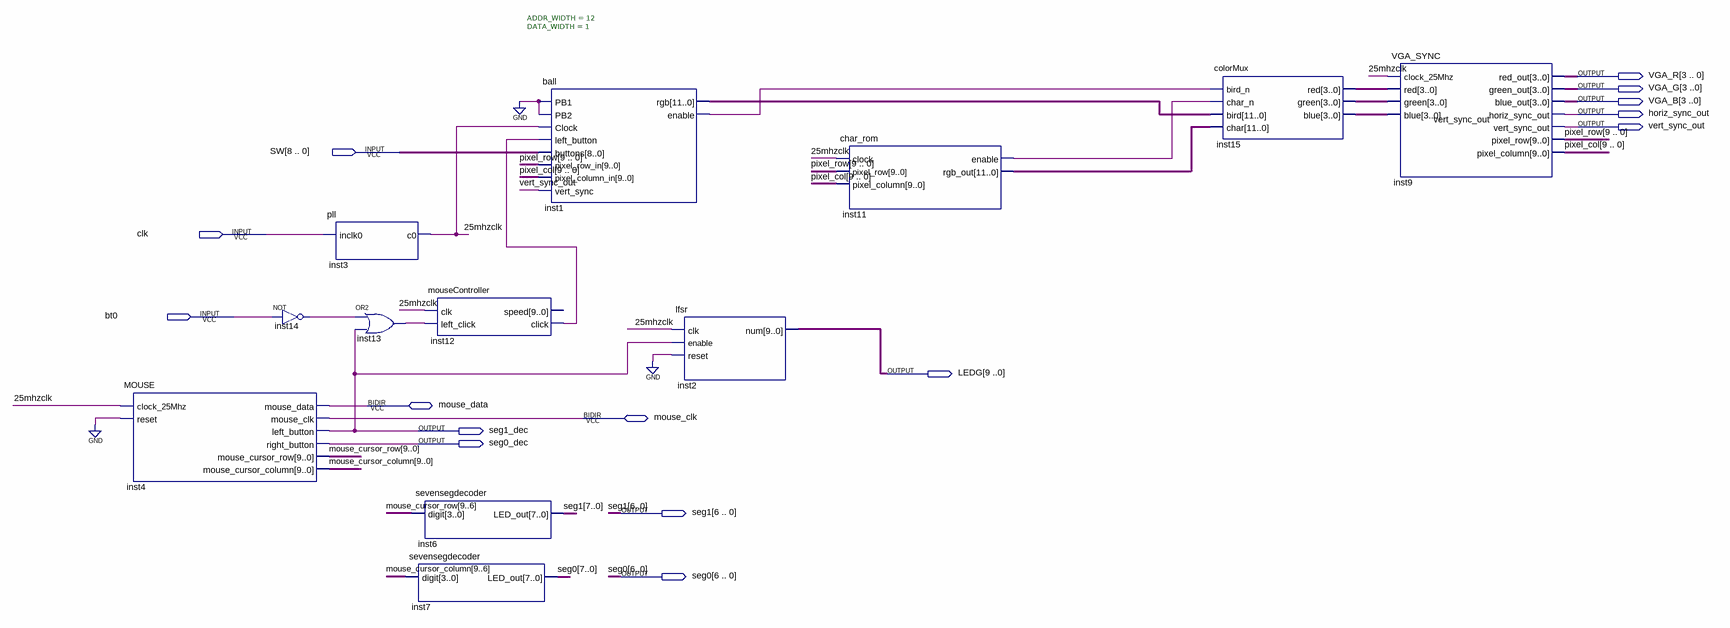
[diagram p0: schematic sheet]
// Quartus schematic BouncingBall.bdf as structural Verilog: 12 symbols, 15 pins
module BouncingBall (
  input  [8:0] SW,
  input  clk,
  input  bt0,
  inout  mouse_data,
  inout  mouse_clk,
  output [3:0] VGA_R,
  output [3:0] VGA_G,
  output [3:0] VGA_B,
  output horiz_sync_out,
  output vert_sync_out,
  output [9:0] LEDG,
  output seg1_dec,
  output seg0_dec,
  output [7:0] seg1,
  output [7:0] seg0
);

  wire \25mhzclk , inst1_enable, inst11_enable, inst12_click, inst13_out, inst14_out;
  wire [3:0] inst15_blue, inst15_green, inst15_red;
  wire [9:0] mouse_cursor_column, mouse_cursor_row, pixel_col, pixel_row;
  wire [11:0] inst1_rgb, inst11_rgb_out;

  MOUSE inst4 (
    .clock_25Mhz(\25mhzclk ), .reset(1'b0), .left_button(seg1_dec), .right_button(seg0_dec),
    .mouse_cursor_row(mouse_cursor_row), .mouse_cursor_column(mouse_cursor_column), .mouse_data(mouse_data),
    .mouse_clk(mouse_clk));
  not inst14 (inst14_out, bt0);
  pll inst3 (.inclk0(clk), .c0(\25mhzclk ));
  or inst13 (inst13_out, inst14_out, seg1_dec);
  mouseController inst12 (.clk(\25mhzclk ), .left_click(inst13_out), .click(inst12_click));  // open: speed
  sevensegdecoder inst6 (.digit(mouse_cursor_row[9:6]), .LED_out(seg1));
  sevensegdecoder inst7 (.digit(mouse_cursor_column[9:6]), .LED_out(seg0));
  ball #(.ADDR_WIDTH(12), .DATA_WIDTH(1)) inst1 (
    .PB1(1'b0), .PB2(1'b0), .Clock(\25mhzclk ), .left_button(inst12_click), .buttons(SW),
    .pixel_row_in(pixel_row), .pixel_column_in(pixel_col), .vert_sync(vert_sync_out), .rgb(inst1_rgb),
    .enable(inst1_enable));
  lfsr inst2 (.clk(\25mhzclk ), .enable(seg1_dec), .reset(1'b0), .num(LEDG));
  char_rom inst11 (
    .clock(\25mhzclk ), .pixel_row(pixel_row), .pixel_column(pixel_col), .enable(inst11_enable),
    .rgb_out(inst11_rgb_out));
  colorMux inst15 (
    .bird_n(inst1_enable), .char_n(inst11_enable), .bird(inst1_rgb), .char(inst11_rgb_out), .red(inst15_red),
    .green(inst15_green), .blue(inst15_blue));
  VGA_SYNC inst9 (
    .clock_25Mhz(\25mhzclk ), .red(inst15_red), .green(inst15_green), .blue(inst15_blue), .red_out(VGA_R),
    .green_out(VGA_G), .blue_out(VGA_B), .horiz_sync_out(horiz_sync_out), .vert_sync_out(vert_sync_out),
    .pixel_row(pixel_row), .pixel_column(pixel_col));
endmodule
